# EAGLE design Retro Lite CM5 Fan FFC (EAGLE 9.6.1)
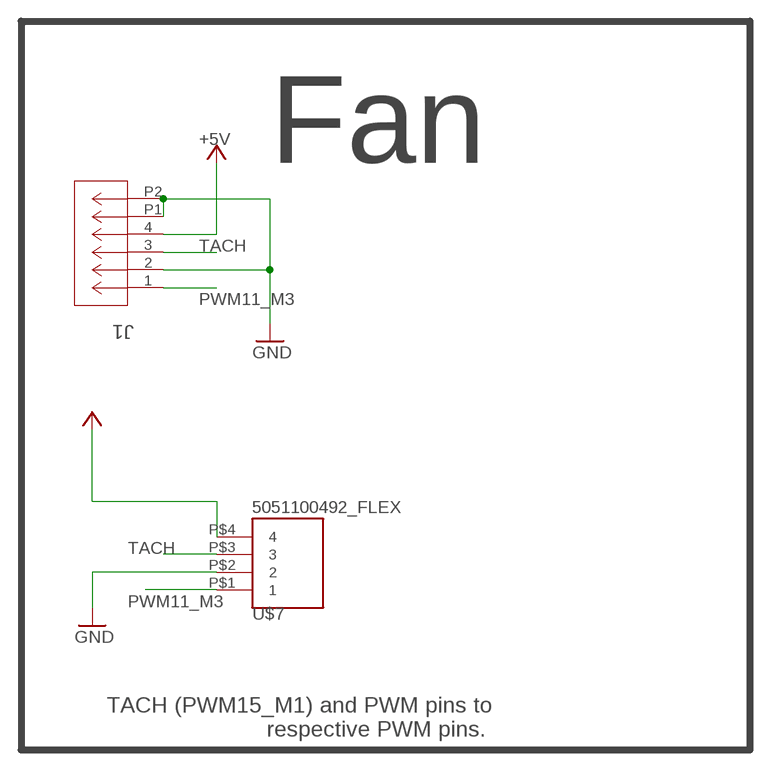
[diagram p0: schematic, sheet 1]

## Parts
J1  5034800440  [CON_5034800440_MOL]
U$7  5051100492_FLEX  [5051100492_FLEX]

## Nets
+5V: J1.4 U$7.P$4 ; supply symbol labelled VSYS
GND: J1.2 J1.P1 J1.P2 U$7.P$2
PWM11_M3: J1.1 U$7.P$1
TACH: J1.3 U$7.P$3

## Notes on the sheet
- Fan
- TACH (PWM15_M1) and PWM pins to
  respective PWM pins.

## Library data of the parts
J1 = 5014610491:5034800440; COPYRIGHT: Copyright (C) 2024 Ultra Librarian. All rights reserved.; MANUFACTURER_PART_NUMBER: 5034800440; MFR_NAME: Molex Connector Corporation
U$7 = 5014610491:5051100492_FLEX

## Net classes
1 USB2.0: width 0.124 mm, clearance 0.102 mm
2 PCIE2.0: width 0.124 mm, clearance 0.102 mm
3 eDP 4th Layer: width 0.113 mm, clearance 0.203 mm
4 RX/TX Pairs: width 0.17 mm
5 eDP 1st Layer: width 0.109 mm, clearance 0.127 mm
6 HDMI0_CLK: width 0.108 mm, clearance 0.102 mm
7 HDMI0_TX0: width 0.108 mm, clearance 0.102 mm
8 HDMI0_TX1: width 0.108 mm, clearance 0.102 mm
9 HDMI0_TX2: width 0.108 mm, clearance 0.102 mm
10 MIPI: width 0.142 mm, clearance 0.203 mm
11 eMMC HS400: width 0.131 mm
12 HDMI 4th Layer: width 0.113 mm, clearance 0.203 mm
13 USB2.0 4th Layer: width 0.106 mm, clearance 0.102 mm
14 USB3.0: width 0.106 mm, clearance 0.102 mm

## Board
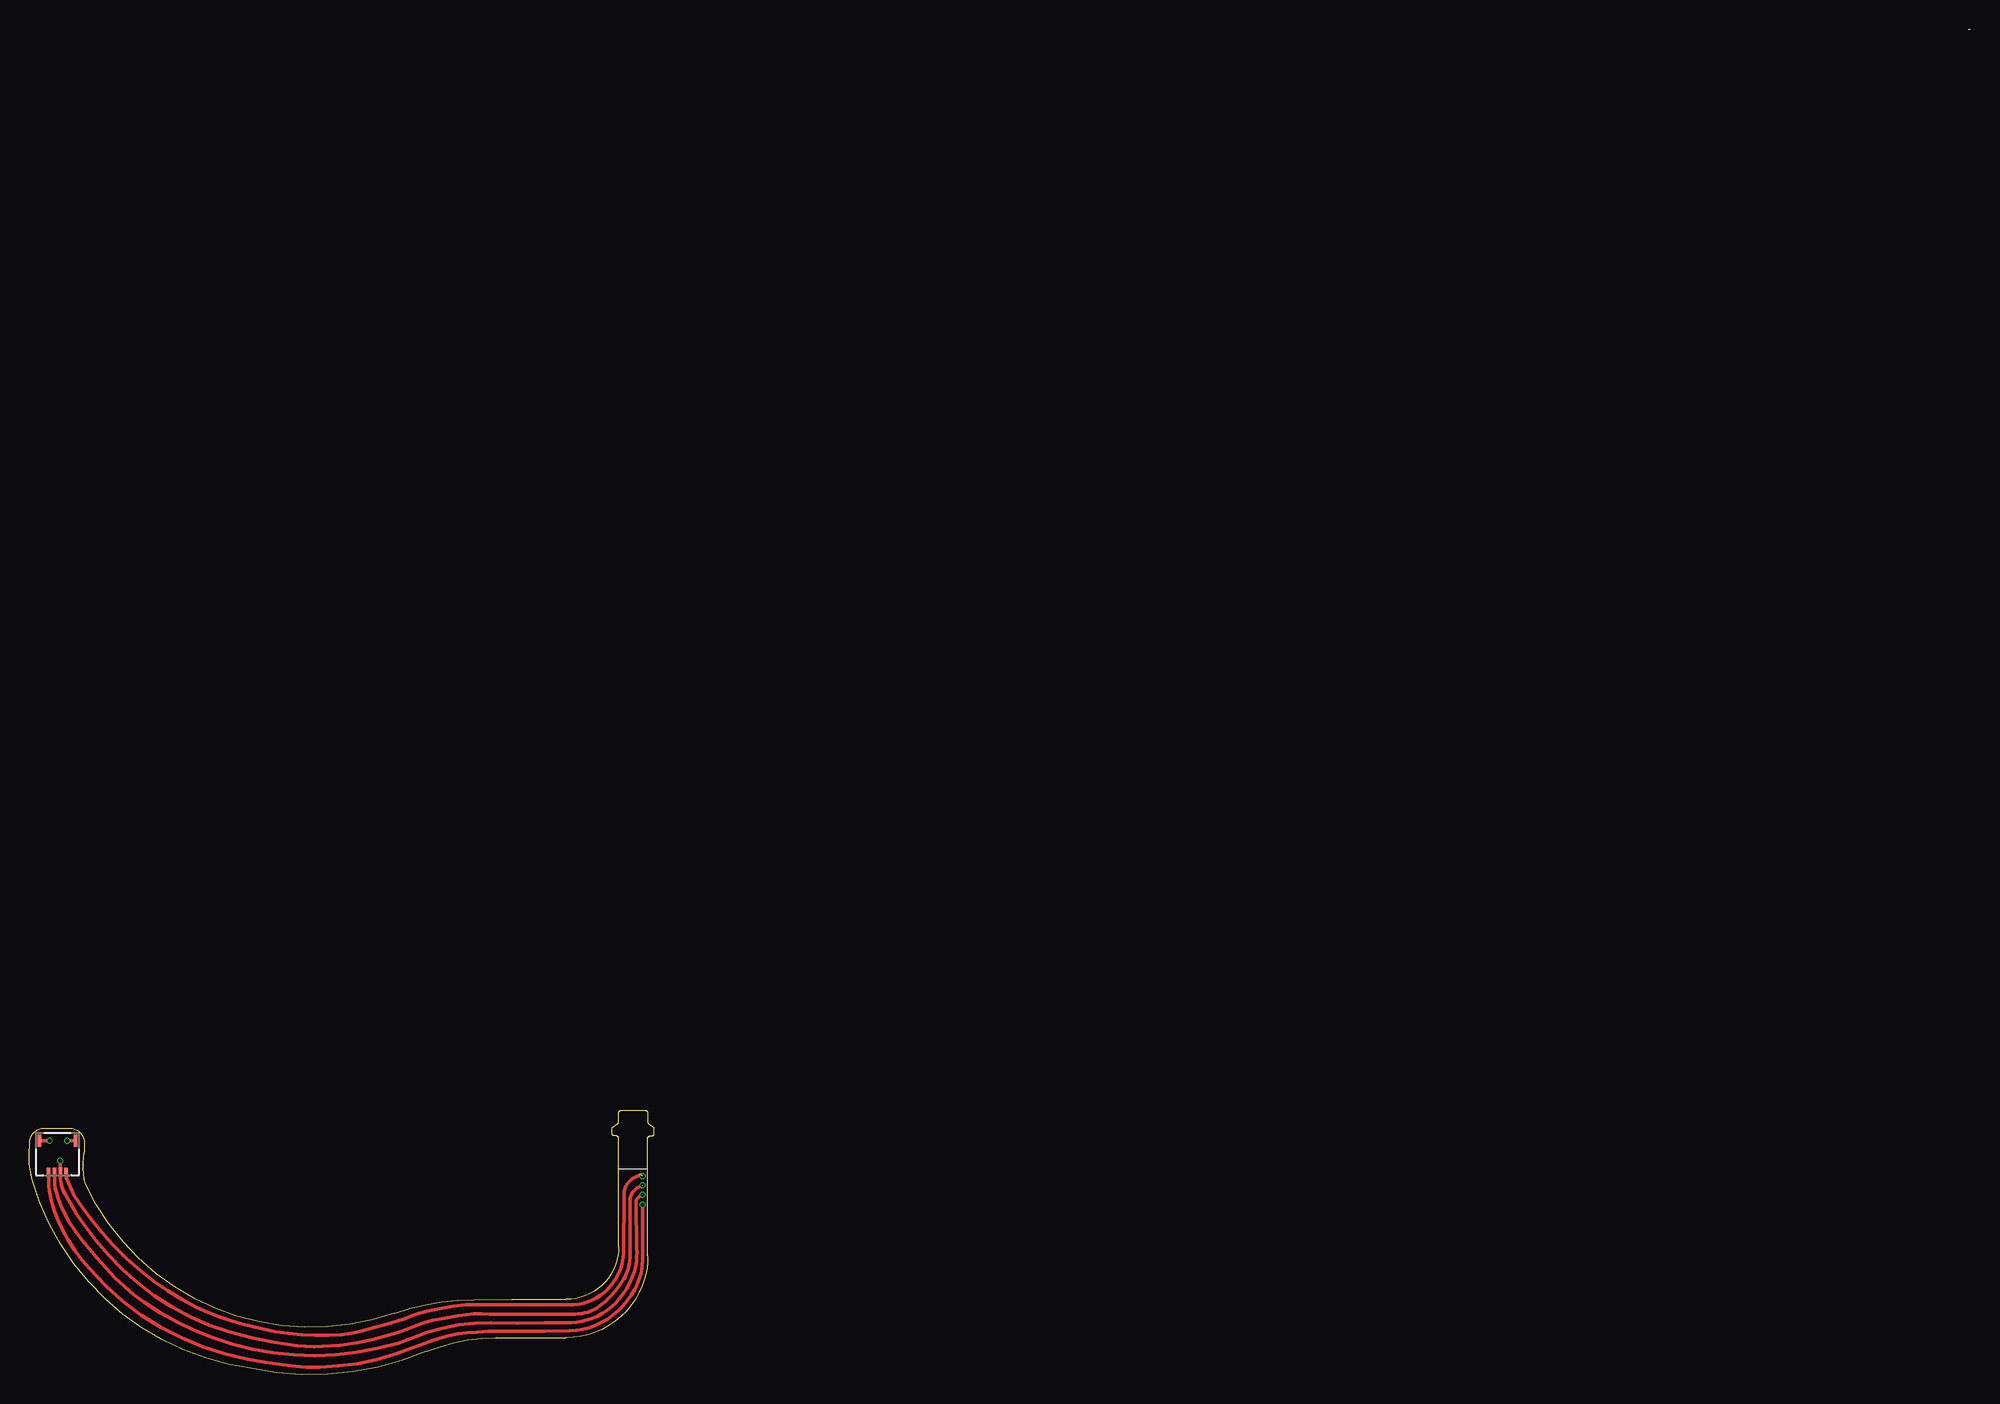
[diagram p1: board, top side]
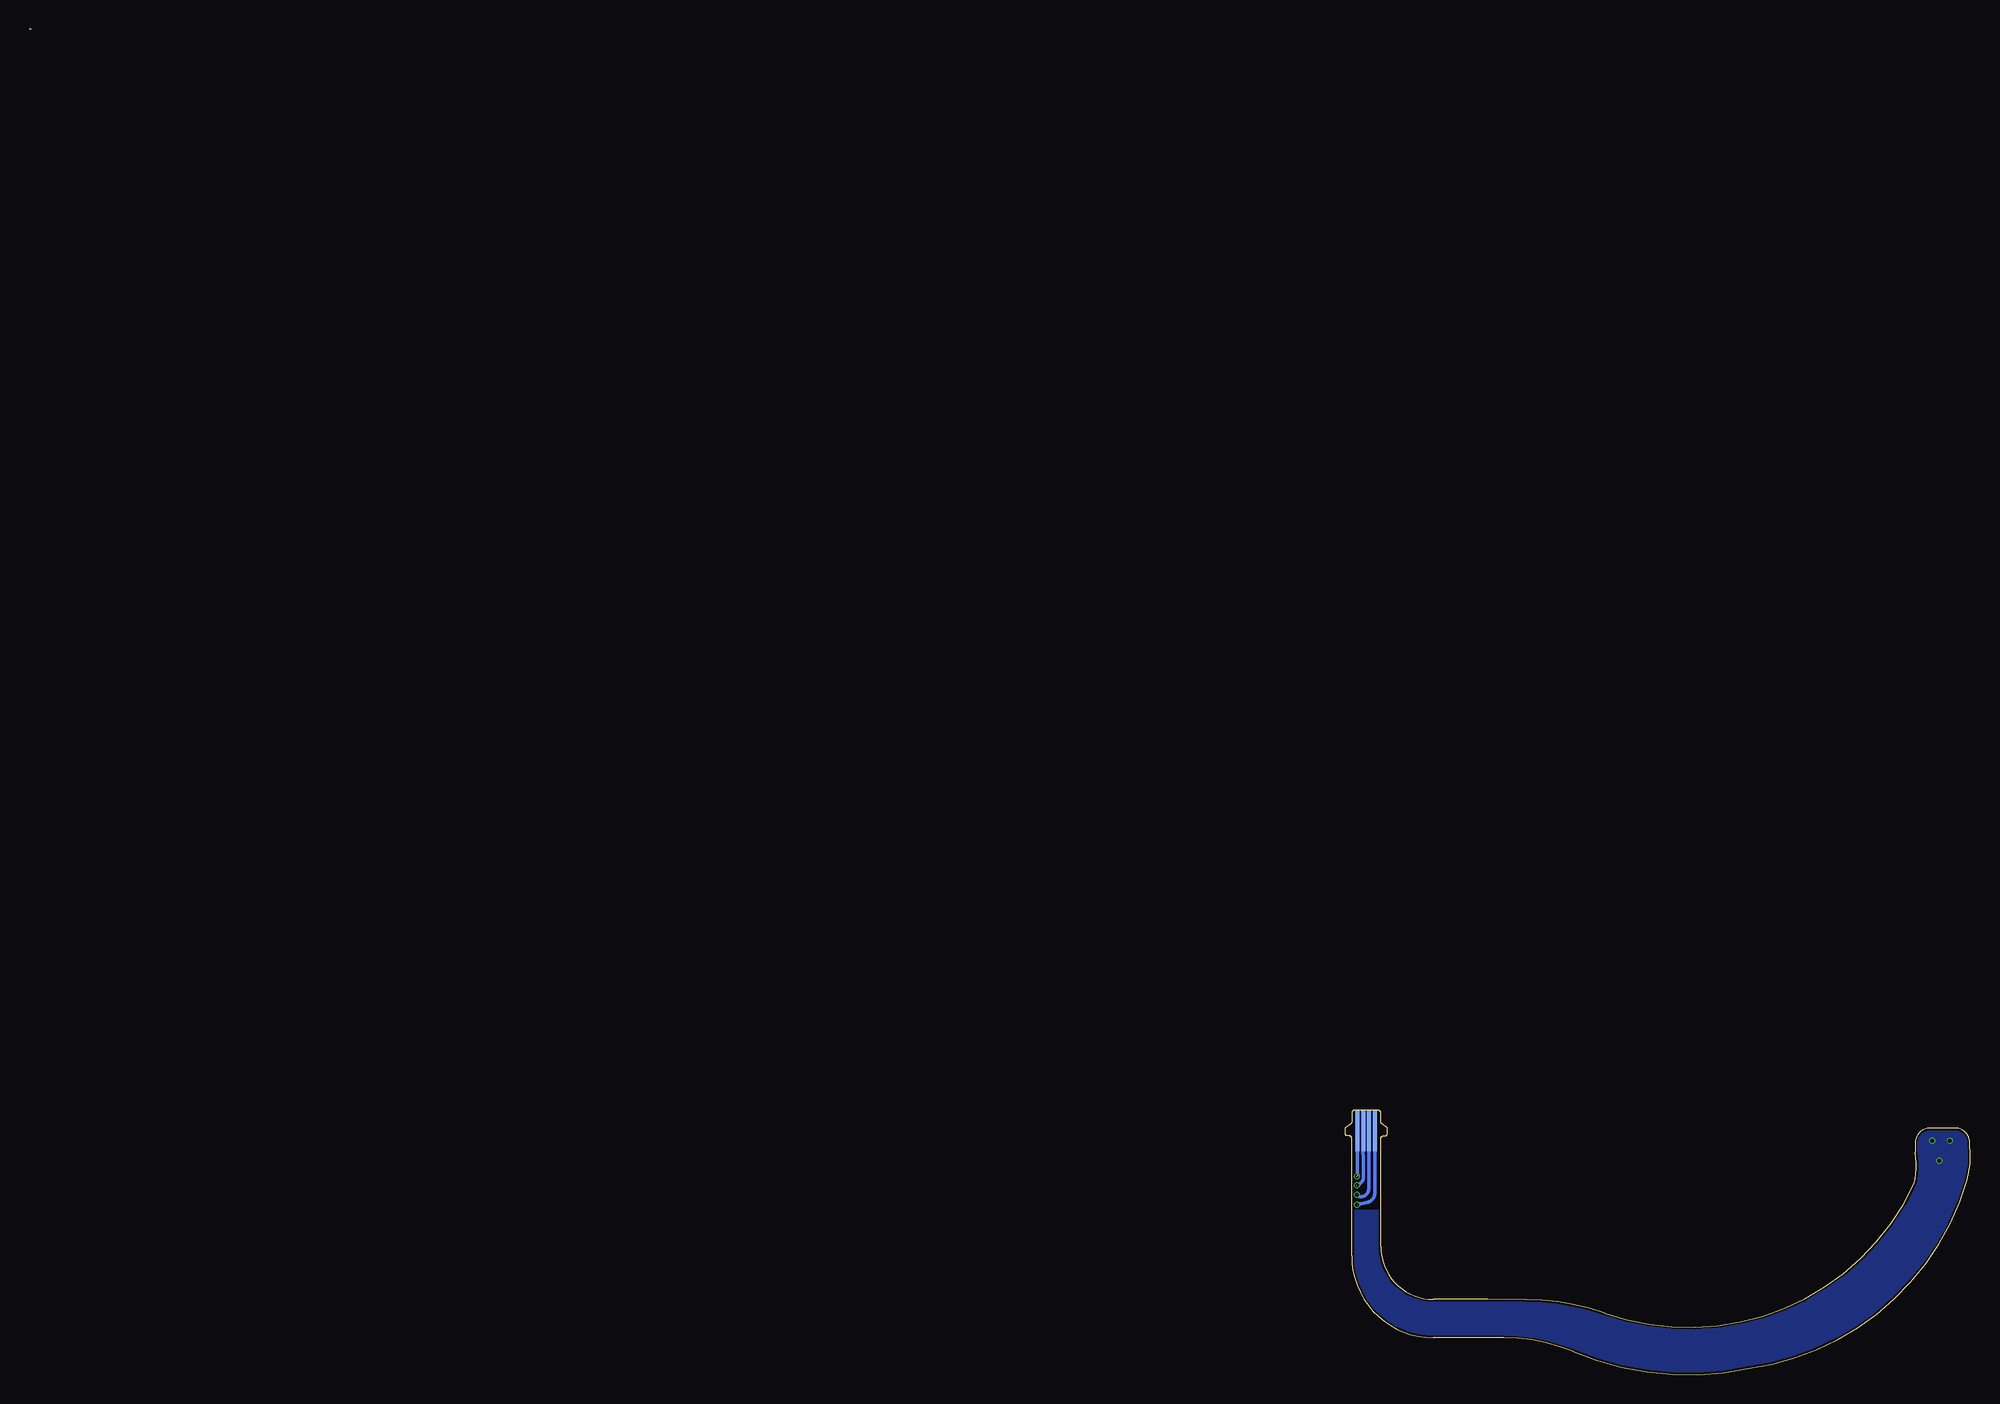
[diagram p2: board, bottom side, seen from below]

Size 166.26 x 115.2 mm. Coordinates in mm from the lower left corner, seen from the top.
Outline: 166.1,115.2 166.26,115.2
Outline: 50.73,22.63 52.73,22.63 arc-90 52.98,22.38 52.98,21.63 arc54 53.07,21.47 53.53,21.13 53.53,20.63 arc-90 53.33,20.43 53.18,20.43 arc90 52.98,20.23 52.98,10.15 arc-90 45.98,3.15 39.97,3.15 arc23 34.05,1.98 arc-35 18.99,0.54 arc-66 0.28,16.66 arc-22 0.02,18.97 0.07,19.68 arc-93 1.14,21.09 3.46,21.09 arc-90 4.73,19.82 4.73,19.02 arc25 4.83,16.28 arc84 31.31,5.27 arc-19 38.05,6.42 41.31,6.44 45.98,6.44 arc90 50.48,10.94 50.48,20.23 arc90 50.28,20.43 50.13,20.43 arc-90 49.93,20.63 49.93,21.13 50.4,21.47 arc54 50.48,21.63 50.48,22.38 arc-90 50.73,22.63
Copper layers (1*16): TopSignal 0.035mm / dielectric 0.1164mm / BottomSignal 0.035mm
Design rules "jlcpcb-6-layer *": minimum track width 3.5mil, minimum drill 0.2mm, track to track 3.5mil, track to pad 3.5mil, pad to pad 3.5mil, via to via 3.5mil, smd to smd 0mil, copper to edge 0.2mm, drill to drill 5mil, minimum pad ring 3mil, minimum via ring 3mil, stop-mask expansion 0mil, vias tented up to drill 100mil, thermal gap 10mil
tKeepout: area 79,47.3 to 85.7,53.7; 70 lines
bRestrict: area 48.7,14.3 to 54.2,23.3

### Footprints (pad centres in the part's own frame; a part is rotated, then mirrored left to right if it is on the bottom)
CON_5034800440_MOL = smd 0.3 x 0.7: 1 -0.75,1.5; 2 -0.25,1.5; 3 0.25,1.5; 4 0.75,1.5 | smd 0.3 x 1: P1 -1.54,-1.15; P2 1.54,-1.15
5051100492_FLEX = smd 0.35 x 3.5: P$1 0.75,0; P$2 0.25,0; P$3 -0.25,0; P$4 -0.75,0

### Placement (x,y rotation side)
J1  2.42,18.87 180 top
U$7  51.75,20.87 180 bottom

### Tracks (layer width: path | path; a pad name or v marks a point on that pad's centre or on a via)
+5V  (via drill 0.35)  (1 unrouted)
  TopSignal 0.305: J1.4 1.67,16.82 arc4 1.71,15.79 arc17 2.85,12.36 arc13 5.17,9.05 arc38 18.7,1.32 arc5 23.21,0.68 arc7 24.88,0.63 arc11 29.72,1.26 arc4 34.37,2.86 arc-20 38.33,3.62 arc-7 39.81,3.7 arc2 46.31,3.75 arc42 50.42,5.44 arc17 51.85,7.28 arc19 52.47,8.98 arc-10 52.54,9.66 52.54,14.52 v52.52,14.53
  BottomSignal 0.305: 50.99,20.86 U$7.P$4 51,15.5 arc69 51.61,14.76 arc24 52.52,14.61 v52.52,14.53
GND  (via drill 0.35)  (1 unrouted)
  TopSignal 0.305: 52.55,16.17 arc71 51.48,15.09 arc4 51.46,14.64 51.48,10.85 arc-14 51.35,9.24 arc-20 50.92,8.15 arc-22 48.83,5.85 arc-37 46.78,5.18 39.45,5.18 arc19 36.07,4.89 arc16 33.08,4.17 arc-5 30.91,3.41 arc-3 29.53,3.03 arc-11 25.15,2.4 arc-9 22.95,2.48 arc-10 17.13,3.65 arc-23 9.28,7.84 arc-16 4.66,12.88 arc-6 3.04,15.51 arc-34 J1.2 v2.67,18.3 | J1.P2 v1.74,20.02 | J1.P1 v3.24,20.02
  BottomSignal 0.305: U$7.P$2 52.03,20.84 51.98,16.82 arc74 52.57,16.24 v52.52,16.2
  pour BottomSignal: -2.76,-1.7 55.74,-1.7 55.74,29.8 -2.76,29.8
PWM11_M3  (via drill 0.35)  (1 unrouted)
  TopSignal 0.305: 52.41,17.11 arc63 50.94,15.65 50.91,10.31 arc-19 50.61,8.93 arc-17 49.84,7.63 arc-51 46.28,5.96 arc1 37.41,5.97 arc11 37.4,5.97 arc7 34.04,5.41 arc-1 33.81,5.34 arc9 33.76,5.32 arc16 32.3,4.83 arc-10 32.16,4.77 arc-1 28.38,3.71 arc-10 26.78,3.43 arc-9 23.33,3.41 arc-9 19.95,3.92 arc-3 17.29,4.62 arc-10 14.3,5.78 arc-14 9.58,8.85 arc-10 6.02,12.43 arc-6 3.86,15.3 3.17,16.87 arc-8 J1.1
  BottomSignal 0.305: v52.52,17 arc-1 52.5,17.02 52.5,18.87 arc0 U$7.P$1
TACH  (via drill 0.35)  (1 unrouted)
  TopSignal 0.305: 2.17,17.1 J1.3 2.17,16.5 arc13 2.35,15.55 arc5 2.72,14.51 arc17 4.37,11.72 arc3 6.59,9.08 arc14 9.84,6.2 arc11 14.12,3.79 arc20 22.63,1.68 arc21 31.6,2.7 arc6 32.76,3.12 arc-24 39.57,4.43 arc2 46.42,4.46 arc49 50.54,6.47 arc21 51.84,8.84 arc13 52.01,9.67 arc7 52.05,10.79 arc-2 51.97,14.81 arc-52 52.54,15.38
  BottomSignal 0.305: U$7.P$3 51.5,16.5 arc9 51.52,15.9 arc109 52.4,15.28 v52.52,15.4